# EAGLE design luxeon_r4_smd (EAGLE 5.08)
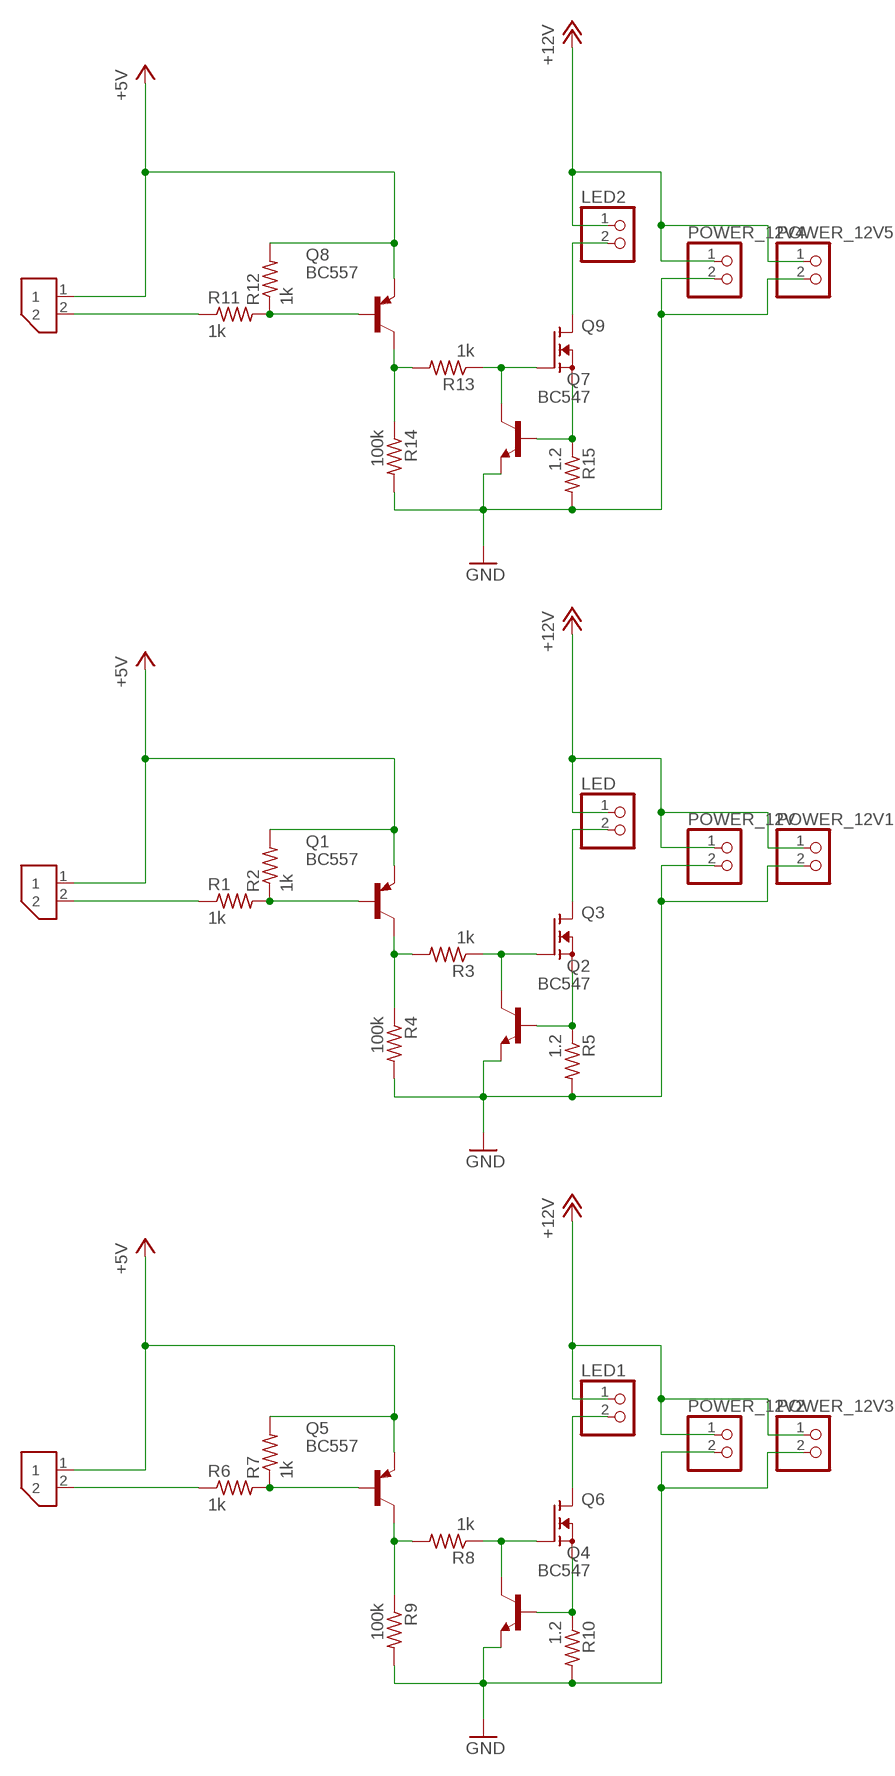
[diagram p0: schematic, sheet 1]

## Parts
LED  PINHD-1X2  [1X02]
LED1  PINHD-1X2  [1X02]
LED2  PINHD-1X2  [1X02]
POWER_12V  PINHD-1X2  [1X02]
POWER_12V1  PINHD-1X2  [1X02]
POWER_12V2  PINHD-1X2  [1X02]
POWER_12V3  PINHD-1X2  [1X02]
POWER_12V4  PINHD-1X2  [1X02]
POWER_12V5  PINHD-1X2  [1X02]
Q1  BC557  [TO92]
Q2  BC547  [TO92]
Q3  TOSHIBA-2SK4033  [TO252]
Q4  BC547  [TO92]
Q5  BC557  [TO92]
Q6  TOSHIBA-2SK4033  [TO252]
Q7  BC547  [TO92]
Q8  BC557  [TO92]
Q9  TOSHIBA-2SK4033  [TO252]
R1  1k  R-US_R0402  [R0402]
R2  1k  R-US_R0402  [R0402]
R3  1k  R-US_R0402  [R0402]
R4  100k  R-US_R0402  [R0402]
R5  1.2  R-US_R2512  [R2512]
R6  1k  R-US_R0402  [R0402]
R7  1k  R-US_R0402  [R0402]
R8  1k  R-US_R0402  [R0402]
R9  100k  R-US_R0402  [R0402]
R10  1.2  R-US_R2512  [R2512]
R11  1k  R-US_R0402  [R0402]
R12  1k  R-US_R0402  [R0402]
R13  1k  R-US_R0402  [R0402]
R14  100k  R-US_R0402  [R0402]
R15  1.2  R-US_R2512  [R2512]
TO_SLAVE  MOLEX-SPOX-HEADER-2-RA  [SPOX-WTB-HEADER-2-RA]
TO_SLAVE1  MOLEX-SPOX-HEADER-2-RA  [SPOX-WTB-HEADER-2-RA]
TO_SLAVE2  MOLEX-SPOX-HEADER-2-RA  [SPOX-WTB-HEADER-2-RA]

## Nets
+5V: Q1.1(E) Q5.1(E) Q8.1(E) R2.2 R7.2 R12.2 TO_SLAVE1.1 TO_SLAVE2.1 TO_SLAVE.1
+12V: LED1.1 LED2.1 LED.1 POWER_12V1.1 POWER_12V2.1 POWER_12V3.1 POWER_12V4.1 POWER_12V5.1 POWER_12V.1
DISSIPATE: LED.2 Q3.3(D)
DISSIPATE1: LED1.2 Q6.3(D)
DISSIPATE2: LED2.2 Q9.3(D)
GND: POWER_12V1.2 POWER_12V2.2 POWER_12V3.2 POWER_12V4.2 POWER_12V5.2 POWER_12V.2 Q2.1(E) Q4.1(E) Q7.1(E) R4.2 R5.2 R9.2 R10.2 R14.2 R15.2
N$1: Q1.2(B) R1.2 R2.1
N$2: Q2.3(C) Q3.1(G) R3.1
N$3: Q1.3(C) R3.2 R4.1
N$4: Q2.2(B) Q3.2(S) R5.1
N$5: Q5.2(B) R6.2 R7.1
N$6: Q5.3(C) R8.2 R9.1
N$7: Q4.2(B) Q6.2(S) R10.1
N$8: Q4.3(C) Q6.1(G) R8.1
N$9: Q8.2(B) R11.2 R12.1
N$10: Q8.3(C) R13.2 R14.1
N$11: Q7.2(B) Q9.2(S) R15.1
N$12: Q7.3(C) Q9.1(G) R13.1
SLV: R1.1 TO_SLAVE.2
SLV1: R6.1 TO_SLAVE1.2
SLV2: R11.1 TO_SLAVE2.2

## Library data of the parts
LED LED1 LED2 POWER_12V POWER_12V1-POWER_12V5 = pinhead:PINHD-1X2: PIN HEADER
Q1 Q5 Q8 = transistor-pnp:BC557: PNP Transistor
Q2 Q4 Q7 = transistor:BC547: NPN TRANSISTOR
Q3 Q6 Q9 = damians_bits:TOSHIBA-2SK4033: TOSHIBA 2SK4033 Field Effect Transistor N-Channel MOSFET
R1-R15 = resistor:R-US_: RESISTOR, American symbol
TO_SLAVE TO_SLAVE1 TO_SLAVE2 = damians_bits:MOLEX-SPOX-HEADER-2-RA: Molex SPOX 22-05-7025 WTB Header, Right-angle, 2 way

## Board
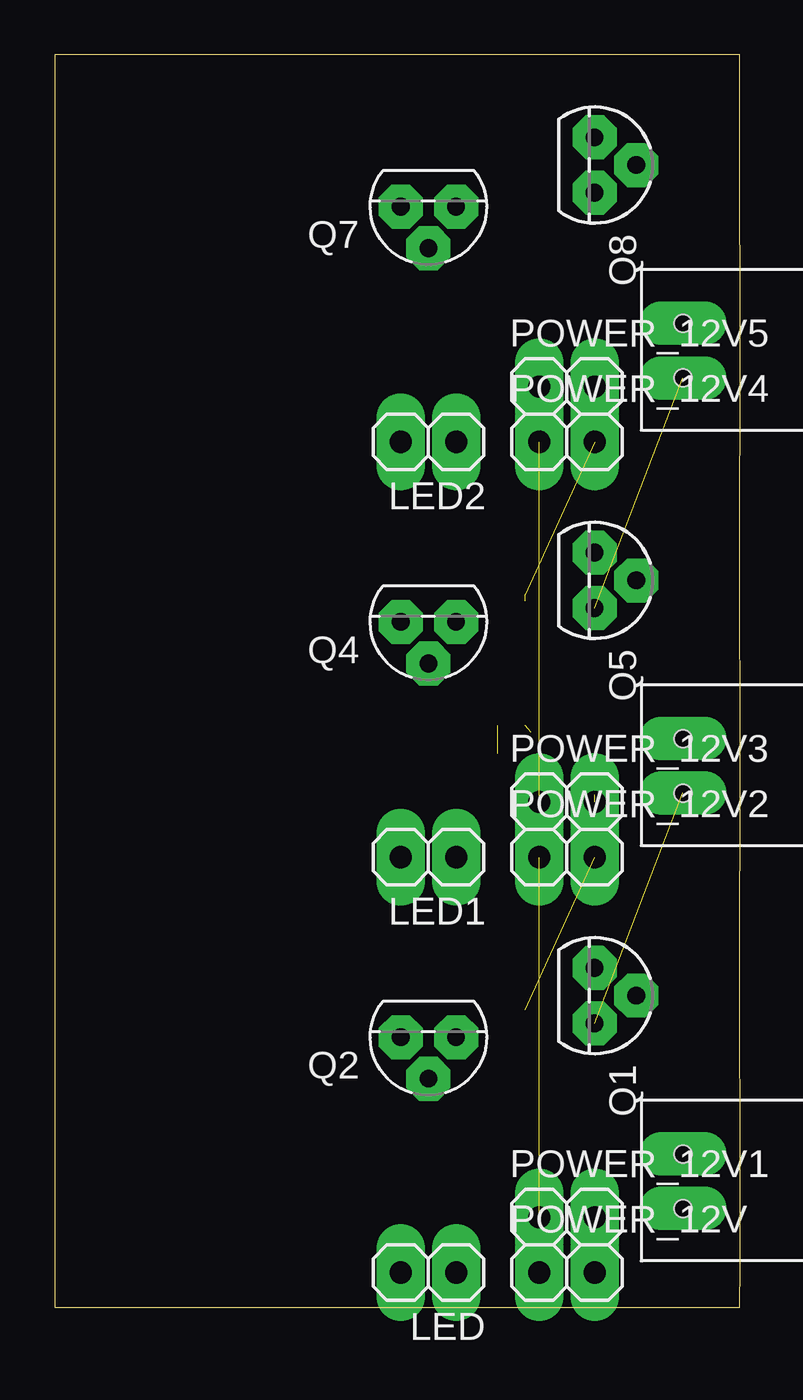
[diagram p1: board, top side]
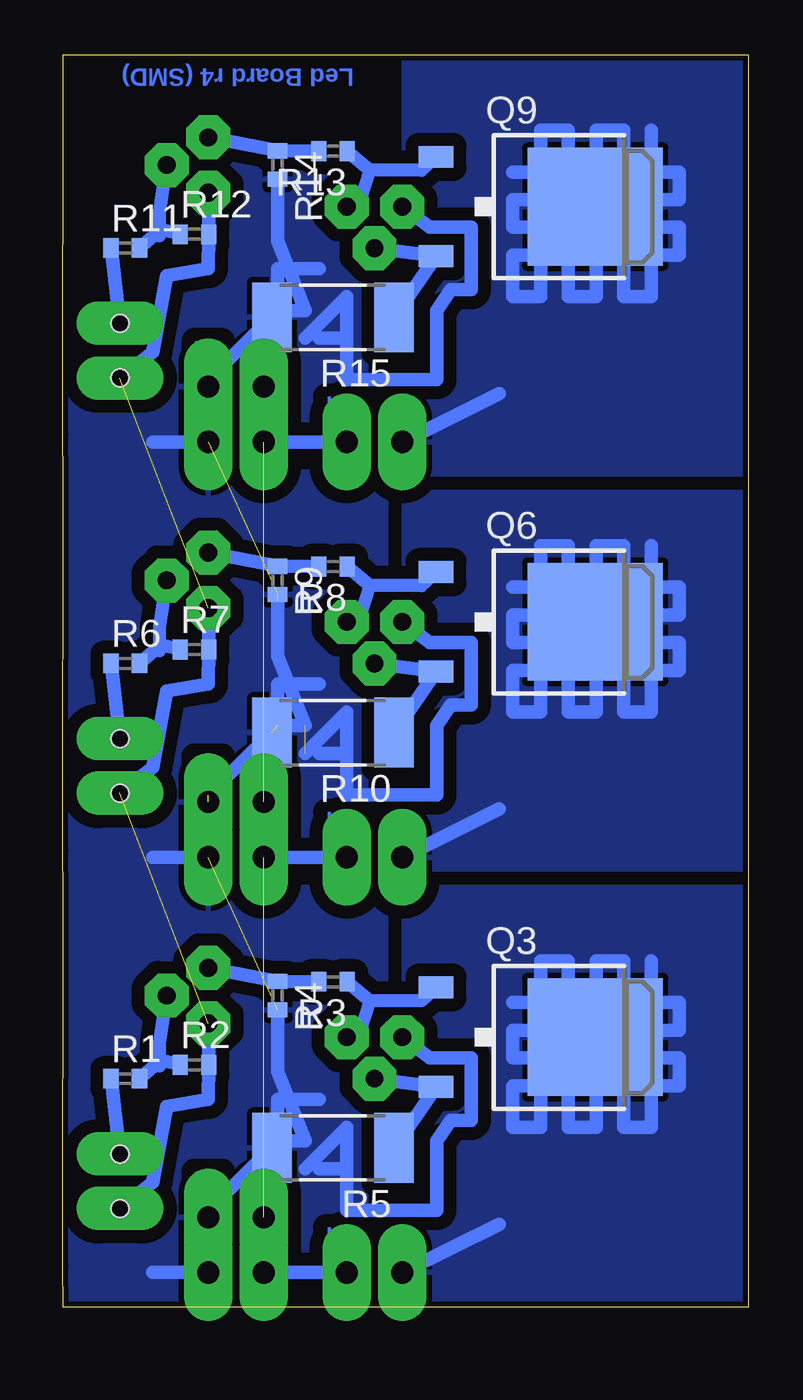
[diagram p2: board, bottom side, seen from below]

Size 31.43 x 57.46 mm. Coordinates in mm from the lower left corner, seen from the top.
Outline: 31.42,19.04 31.43,1.91 31.42,0 0,0 0,19.04
Outline: 31.42,19.05 31.43,20.95 31.42,38.41
Outline: 0,38.41 0,19.05
Outline: 31.42,38.1 31.43,40.01 31.42,57.46 0,57.46 0,38.1
Copper layers (1*16): Top 0.035mm / dielectric 1.5mm / Bottom 0.035mm
Design rules "default *": minimum track width 0.6mm, minimum drill 0.8mm, track to track 0.6mm, track to pad 0.6mm, pad to pad 0.45mm, via to via 0.6mm, smd to smd 8mil, copper to edge 10mil, drill to drill 8mil, minimum pad ring 0.6mm, minimum via ring 0.6mm, stop-mask expansion 0mil, vias tented up to drill 0mil, thermal gap 10mil

### Footprints (pad centres in the part's own frame; a part is rotated, then mirrored left to right if it is on the bottom)
1X02 = drill 1.016 long: 1 -1.27,0; 2 1.27,0
TO92 = drill 0.813 octagon: 1 1.27,0; 2 0,1.905; 3 -1.27,0
TO252 = smd 1 x 1.6: 1 -2.28,-4.8; 2 2.28,-4.8 | smd 5.4 x 6.2: 3 0,2.5
R0402 = smd 0.7 x 0.9: 1 -0.65,0; 2 0.65,0
R2512 = smd 1.8 x 3.2: 1 -2.8,0; 2 2.8,0
SPOX-WTB-HEADER-2-RA = drill 0.8 long: 1 1.19,0.56; 2 -1.31,0.56 | hole 0.8: -1.31,0.56; 1.19,0.56

### Placement (x,y rotation side)
LED  17.14,1.59 180 top
LED1  17.14,20.64 180 top
LED2  17.14,39.69 180 top
POWER_12V  23.5,1.59 0 top
POWER_12V1  23.5,4.13 0 top
POWER_12V2  23.5,20.64 0 top
POWER_12V3  23.5,23.18 0 top
POWER_12V4  23.5,39.69 0 top
POWER_12V5  23.5,42.23 0 top
Q1  24.77,14.29 270 top
Q2  17.14,12.38 180 top
Q3  9.53,12.38 270 bottom
Q4  17.14,31.43 180 top
Q5  24.77,33.34 270 top
Q6  9.53,31.43 270 bottom
Q7  17.14,50.48 180 top
Q8  24.77,52.39 270 top
Q9  9.53,50.48 270 bottom
R1  28.57,10.48 0 bottom
R2  25.4,11.11 0 bottom
R3  19.05,14.92 180 bottom
R4  21.59,14.29 270 bottom
R5  19.05,7.3 180 bottom
R6  28.57,29.53 0 bottom
R7  25.4,30.16 0 bottom
R8  19.05,33.97 180 bottom
R9  21.59,33.34 270 bottom
R10  19.05,26.35 180 bottom
R11  28.57,48.58 0 bottom
R12  25.4,49.21 0 bottom
R13  19.05,53.02 180 bottom
R14  21.59,52.39 270 bottom
R15  19.05,45.4 180 bottom
TO_SLAVE  28.26,5.71 270 top
TO_SLAVE1  28.26,24.77 270 top
TO_SLAVE2  28.26,43.81 270 top

### Tracks (layer width: path | path; a pad name or v marks a point on that pad's centre or on a via)
+5V  (2 unrouted)
  Bottom 0.61: TO_SLAVE.1 27.3,5.71 26.67,9.21 24.77,9.53 R2.2 Q1.1 | TO_SLAVE2.1 27.3,43.81 26.67,47.31 24.77,47.62 R12.2 Q8.1 | TO_SLAVE1.1 27.3,24.77 26.67,28.26 24.77,28.57 R7.2 Q5.1
+12V  (2 unrouted)
  Bottom 0.61: POWER_12V1.1 POWER_12V.1 LED.1 | POWER_12V3.1 POWER_12V2.1 LED1.1 | POWER_12V5.1 POWER_12V4.1 LED2.1
DISSIPATE
  Bottom 0.61: 4.45,15.88 4.45,8.26 5.71,8.26 5.71,15.88 6.99,15.88 6.99,8.26 8.26,8.26 8.26,15.88 9.53,15.88 9.53,8.26 10.79,8.26 10.79,10.16 3.17,10.16 3.17,11.43 10.79,11.43 10.79,12.7 3.17,12.7 3.17,13.97 10.79,13.97 | 11.43,3.81 LED.2
  pour Bottom (isolate 0.254): 15.88,19.37 0,19.37 0,0 17.14,0 17.14,5.4 13.97,8.57 12.7,9.21 15.88,11.11
DISSIPATE1
  Bottom 0.61: 4.45,34.92 4.45,27.3 5.71,27.3 5.71,34.92 6.99,34.92 6.99,27.3 8.26,27.3 8.26,34.92 9.53,34.92 9.53,27.3 10.79,27.3 10.79,29.21 3.17,29.21 3.17,30.48 10.79,30.48 10.79,31.75 3.17,31.75 3.17,33.02 10.79,33.02 | 11.43,22.86 LED1.2
  pour Bottom (isolate 0.254, rank 3): 15.88,38.42 0,38.42 0,19.05 17.14,19.05 17.14,24.45 13.97,27.62 12.7,28.26 15.88,30.16
DISSIPATE2
  Bottom 0.61: 4.45,53.98 4.45,46.35 5.71,46.35 5.71,53.98 6.99,53.98 6.99,46.35 8.26,46.35 8.26,53.98 9.53,53.98 9.53,46.35 10.79,46.35 10.79,48.26 3.17,48.26 3.17,49.53 10.79,49.53 10.79,50.8 3.17,50.8 3.17,52.07 10.79,52.07 | 11.43,41.91 LED2.2
  pour Bottom (isolate 0.254, rank 2): 15.88,57.47 0,57.47 0,38.1 17.14,38.1 17.14,43.5 13.97,46.67 12.7,47.31 15.88,49.21
GND  (6 unrouted)
  Bottom 0.61: 18.41,6.35 19.68,6.35 | 18.41,6.35 18.41,8.26 20.32,6.35 | 19.68,9.53 21.59,9.53 21.59,7.62 20.32,7.62 21.59,10.79 21.59,13.34 | Q2.1 14.61,11.43 12.7,11.43 12.7,8.57 13.65,8.57 14.29,7.62 14.29,4.45 18.41,4.45 18.41,6.35 | R5.2 24.77,4.45 POWER_12V.2 27.3,1.59 | 18.41,44.45 19.68,44.45 | 18.41,44.45 18.41,46.35 20.32,44.45 | 19.68,47.62 21.59,47.62 21.59,45.72 20.32,45.72 21.59,48.9 21.59,51.44 | Q7.1 14.61,49.53 12.7,49.53 12.7,46.67 13.65,46.67 14.29,45.72 14.29,42.55 18.41,42.55 18.41,44.45 | R15.2 24.77,42.55 POWER_12V4.2 27.3,39.69 | 18.41,25.4 19.68,25.4 | 18.41,25.4 18.41,27.3 20.32,25.4 | 19.68,28.57 21.59,28.57 21.59,26.67 20.32,26.67 21.59,29.84 21.59,32.38 | Q4.1 14.61,30.48 12.7,30.48 12.7,27.62 13.65,27.62 14.29,26.67 14.29,23.5 18.41,23.5 18.41,25.4 | R10.2 24.77,23.5 POWER_12V2.2 27.3,20.64
  pour Bottom (rank 6): 31.43,0 31.43,19.37 15.88,19.37 15.88,11.11 12.7,9.21 14.61,8.26 17.46,5.4 17.46,0
  pour Bottom (rank 6): 31.43,38.1 31.43,57.47 15.88,57.47 15.88,49.21 12.7,47.31 14.61,46.35 17.46,43.5 17.46,38.1
  pour Bottom (rank 6): 31.43,19.05 31.43,38.42 15.88,38.42 15.88,30.16 12.7,28.26 14.61,27.3 17.46,24.45 17.46,19.05
N$1
  Bottom 0.6: R2.1 26.95,11.32 27,11.05 27,12.14 Q1.2
  Bottom 0.61: 26.95,11.32 R1.2
N$2
  Bottom 0.6: Q3.1 15,14.05 17.36,14.05 18,12.05 Q2.3
  Bottom 0.61: 17.36,14.05 R3.1
N$3
  Bottom 0.61: R3.2 R4.1 Q1.3
N$4
  Bottom 0.61: Q2.2 Q3.2 R5.1
N$5
  Bottom 0.6: R7.1 26.95,30.37 27,30.1 27,31.19 Q5.2
  Bottom 0.61: 26.95,30.37 R6.2
N$6
  Bottom 0.61: R8.2 R9.1 Q5.3
N$7
  Bottom 0.61: Q4.2 Q6.2 R10.1
N$8
  Bottom 0.6: Q6.1 15,33.1 17.36,33.1 18,31.1 Q4.3
  Bottom 0.61: 17.36,33.1 R8.1
N$9
  Bottom 0.6: R12.1 26.95,49.42 27,49.15 27,50.24 Q8.2
  Bottom 0.61: 26.95,49.42 R11.2
N$10
  Bottom 0.61: R13.2 R14.1 Q8.3
N$11
  Bottom 0.61: Q7.2 Q9.2 R15.1
N$12
  Bottom 0.6: Q9.1 15,52.15 17.36,52.15 18,50.15 Q7.3
  Bottom 0.61: 17.36,52.15 R13.1
SLV
  Bottom 0.61: TO_SLAVE.2 R1.1
SLV1
  Bottom 0.61: TO_SLAVE1.2 R6.1
SLV2
  Bottom 0.61: TO_SLAVE2.2 R11.1

### Text on the board
Bottom: Led Board r4 (SMD) | S+ | V- | L+ | V- | S+ | L+ | V- | S+ | L+